# Altium schematic sheet remove_file.SchDoc
size A
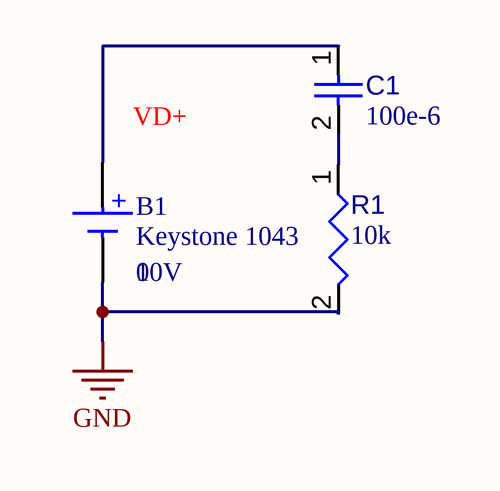
[diagram p0: remove_file.SchDoc]

## Parts
B1  Keystone 1043  value 10V  Offset: 0
C1  value 100e-6  [CAPC3216X180X20ML20]  (hidden comment: Capacitor 1 uF +/- 10% 25 V 1206)
R1  value 10k  [RESC1005X40X25ML05T05]  (hidden comment: Resistor 10k +/-1% 0402 100 mW)

## Nets
GND: B1.2(-) R1.2
NetB1_1: B1.1(+) C1.1
NetC1_2: C1.2 R1.1

## Library data of the parts
C1 = CMP-001-00006-4: Chip Capacitor, 1 uF, +/- 10%, 25 V, 1206 (3216 Metric); Voltage Rating: 25V; Capacitor Type: Ceramic; RoHS Compliant: True; Pins: 2; Min Operating Temperature: -55°C; Mounting Technology: SM; Max Operating Temperature: 125°C; Tolerance: 10%; Case/Package: 1206
R1 = CMP-009-00015-4: Chip Resistor, 10 KOhm, +/- 1%, 0.1 W, -55 to 155 degC, 0402 (1005 Metric); Voltage Rating: 50V; Power: 100mW; Mounting Technology: SM; Min Operating Temperature: -55°C; Case/Package: 0402; Pins: 2; RoHS Compliant: True; Tolerance: 1%; Max Operating Temperature: 155°C